# EAGLE design main (EAGLE 7.6.0)
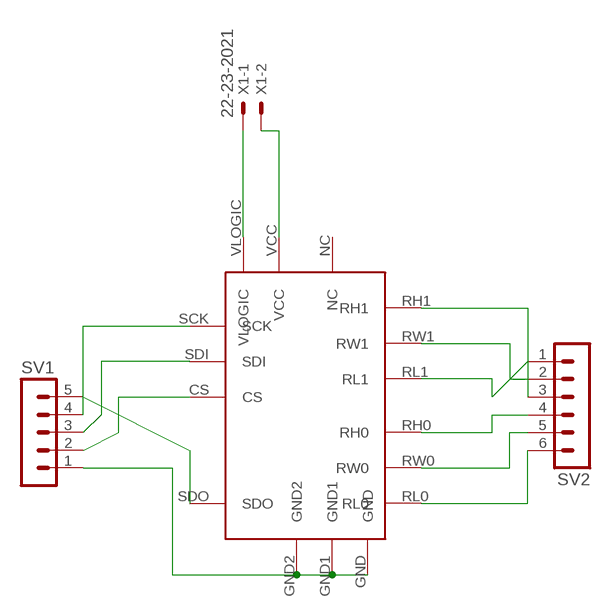
[diagram p0: schematic, sheet 1]

## Parts
SV1  MA05-1  [MA05-1]
SV2  MA06-1  [MA06-1]
U$1  ISL23428  [UTQFN16]
X1  22-23-2021  [22-23-2021]

## Nets
N$1: SV1.1 U$1.GND U$1.GND1 U$1.GND2
N$2: SV1.4 U$1.SCK
N$3: SV1.3 U$1.SDI
N$4: SV1.2 U$1.CS
N$5: SV1.5 U$1.SDO
N$7: SV2.6 U$1.RL0
N$8: SV2.5 U$1.RW0
N$9: SV2.4 U$1.RH0
N$10: SV2.3 U$1.RH1
N$11: SV2.2 U$1.RW1
N$12: SV2.1 U$1.RL1
N$13: U$1.VLOGIC X1.1
N$14: U$1.VCC X1.2
Unconnected: U$1.NC

## Library data of the parts
SV1 = con-lstb:MA05-1: PIN HEADER; OC_FARNELL: unknown; OC_NEWARK: unknown
SV2 = con-lstb:MA06-1: PIN HEADER; OC_FARNELL: unknown; OC_NEWARK: unknown
U$1 = 7_segment_lib:ISL23428
X1 = con-molex:22-23-2021: .100" (2.54mm) Center Header - 2 Pin; MF: MOLEX; MPN: 22-23-2021; OC_FARNELL: 1462926; OC_NEWARK: 25C3832

## Board
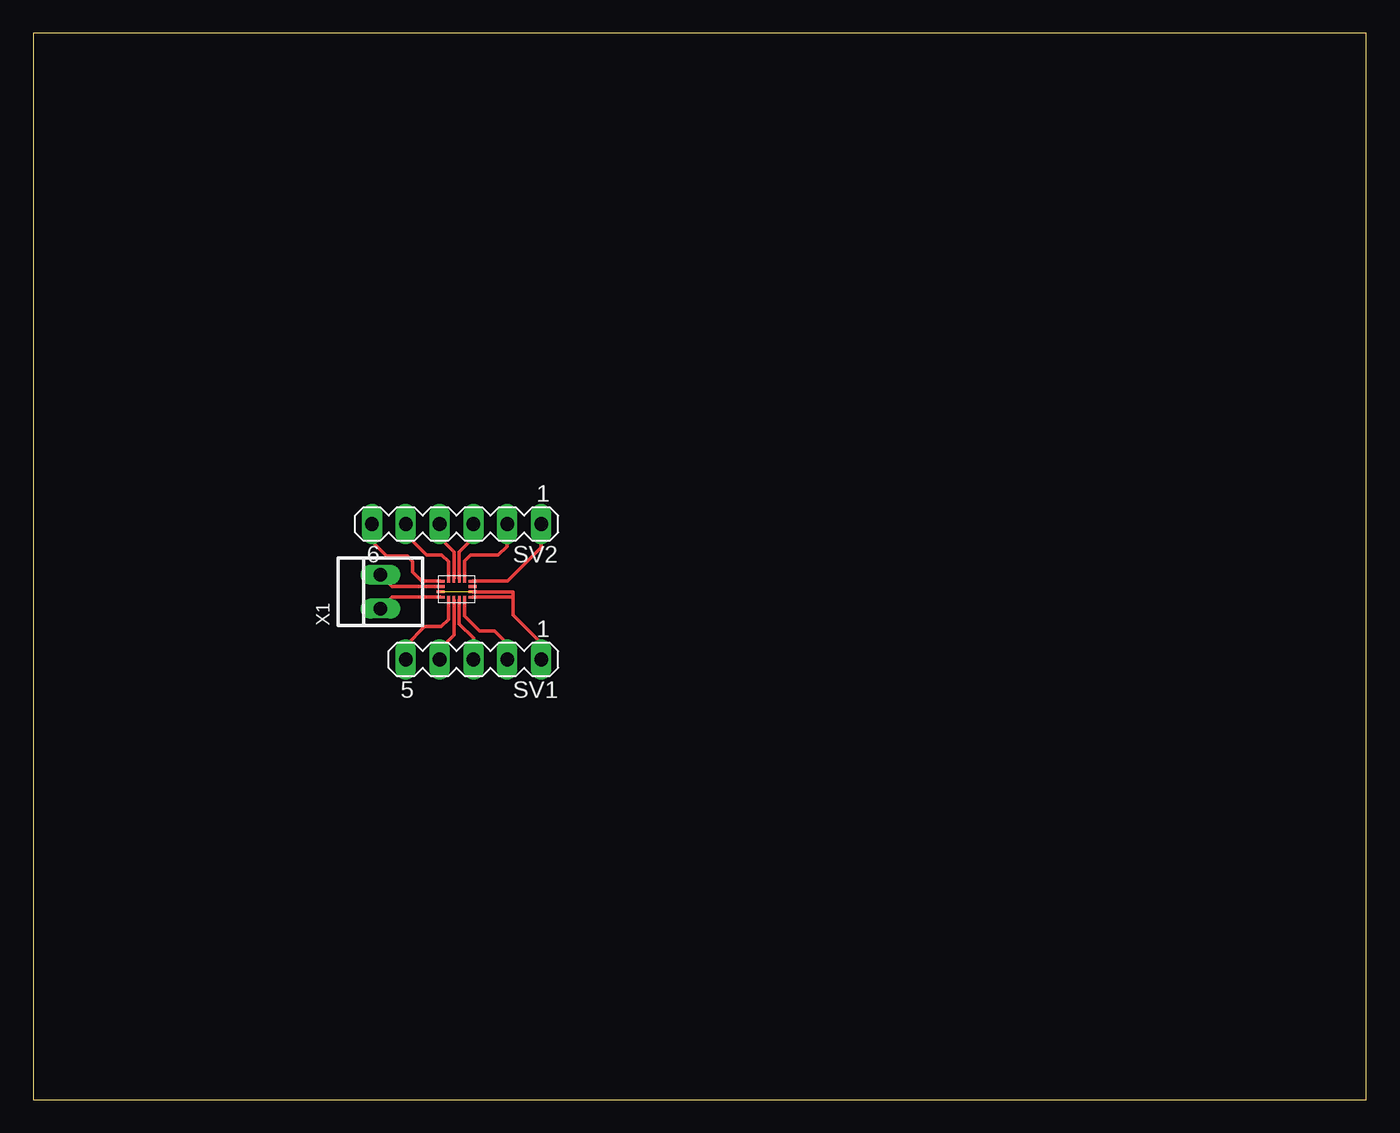
[diagram p1: board, top side]

Size 100 x 80 mm. Coordinates in mm from the lower left corner, seen from the top.
Outline: 0,0 100,0 100,80 0,80 0,0
Copper layers (1*16): Top 0.035mm / dielectric 1.5mm / Bottom 0.035mm
Design rules "default": minimum track width 10mil, minimum drill 24mil, track to track 8mil, track to pad 8mil, pad to pad 8mil, via to via 8mil, smd to smd 8mil, copper to edge 40mil, drill to drill 8mil, minimum pad ring 10mil, minimum via ring 8mil, stop-mask expansion 4mil, vias tented up to drill 0mil, thermal gap 10mil

### Footprints (pad centres in the part's own frame; a part is rotated, then mirrored left to right if it is on the bottom)
MA05-1 = drill 1.016 long: 1 -5.08,0; 2 -2.54,0; 3 0,0; 4 2.54,0; 5 5.08,0
MA06-1 = drill 1.016 long: 1 -6.35,0; 2 -3.81,0; 3 -1.27,0; 4 1.27,0; 5 3.81,0; 6 6.35,0
UTQFN16 = smd 0.2 x 0.6: CS 0.6,-0.6; RH0 -0.2,1; RH1 0.2,1; RW0 -0.6,1; RW1 0.6,1; SCK -0.2,-0.6; SDI 0.2,-0.6; SDO -0.6,-0.6 | smd 0.6 x 0.2: GND 1.2,-0.4; GND1 1.2,0; GND2 -1.2,0; NC 1.2,0.4; RL0 -1.2,0.8; RL1 1.2,0.8; VCC -1.2,0.4; VLOGIC -1.2,-0.4
22-23-2021 = drill 1 long: 1 -1.27,0; 2 1.27,0

### Placement (x,y rotation side)
SV1  33.02,33.02 180 top
SV2  31.75,43.18 180 top
U$1  31.75,38.1 0 top
X1  26.04,38.1 90 top

### Tracks (layer width: path | path; a pad name or v marks a point on that pad's centre or on a via)
N$1  (1 unrouted)
  Top 0.254: U$1.GND1 35.99,38.1 35.99,37.7 | U$1.GND 35.99,37.7 | SV1.1 38.1,34.25 35.99,36.35 35.99,37.7
N$2
  Top 0.254: U$1.SCK 31.55,34.85 30.48,33.78 SV1.4
N$3
  Top 0.254: U$1.SDI 31.95,35.69 33.02,34.62 SV1.3
N$4
  Top 0.254: U$1.CS 32.35,36.28 33.48,35.15 34.62,35.15 35.56,34.21 SV1.2
N$5
  Top 0.254: U$1.SDO 31.15,36.03 30.61,35.48 29.36,35.48 27.96,34.09 27.96,33.05 SV1.5
N$7
  Top 0.254: U$1.RL0 29.12,38.9 28.45,39.57 28.45,40.39 28.07,40.77 26.52,40.77 25.43,41.86 25.43,43.16 SV2.6
N$8
  Top 0.254: U$1.RW0 31.15,40.35 30.63,40.87 29.49,40.87 27.94,42.42 SV2.5
N$9
  Top 0.254: U$1.RH0 31.55,41.09 30.56,42.09 30.56,43.1 SV2.4
N$10
  Top 0.254: U$1.RH1 31.95,41.09 32.99,42.14 32.99,43.16 SV2.3
N$11
  Top 0.254: U$1.RW1 32.35,40.4 32.79,40.84 34.87,40.84 35.53,41.5 35.53,43.16 SV2.2
N$12
  Top 0.254: U$1.RL1 35.57,38.9 38.1,41.43 SV2.1
N$13
  Top 0.254: U$1.VLOGIC 26.91,37.7 X1.1
N$14
  Top 0.254: U$1.VCC 26.91,38.5 X1.2